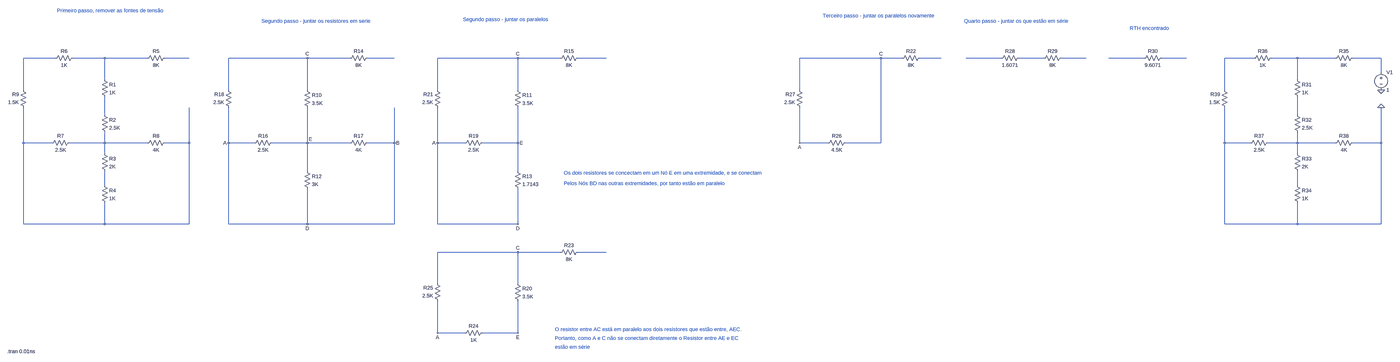
[diagram p0: schematic Mesh2.asc, whole sheet]
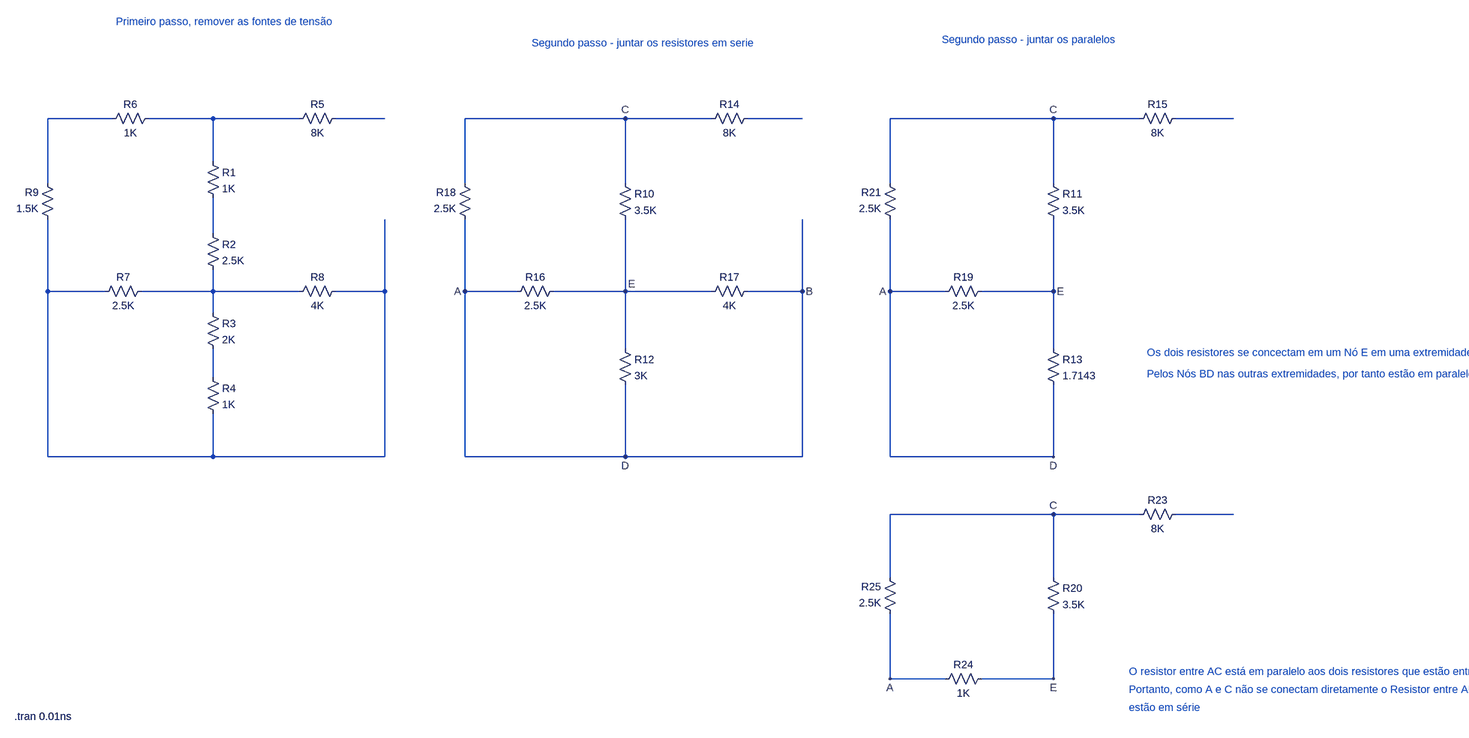
[diagram p1: schematic Mesh2.asc, part, row 1 of 1, column 1 of 2]
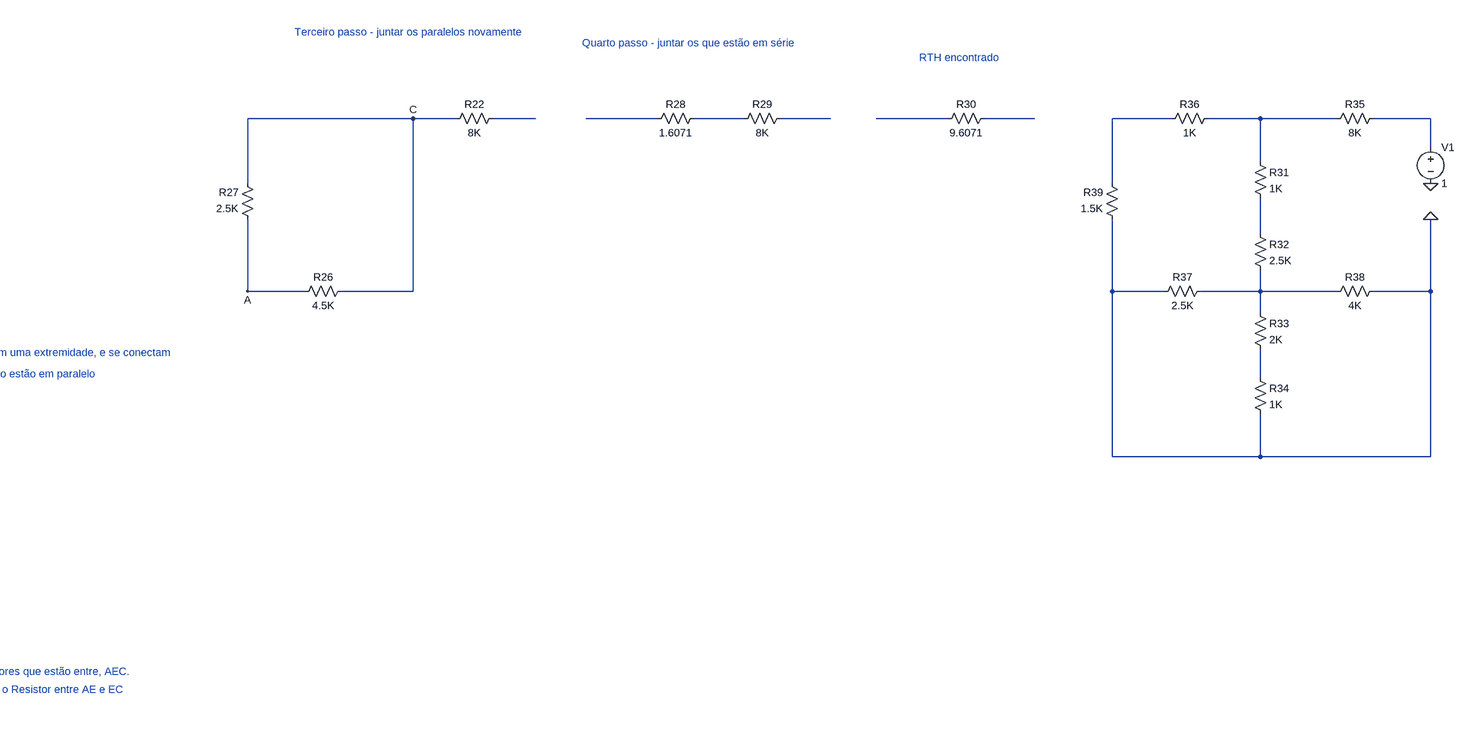
[diagram p2: schematic Mesh2.asc, part, row 1 of 1, column 2 of 2]
Mesh2.asc, the LTspice schematic file:
Version 4
SHEET 1 7416 1708
WIRE 96 16 -48 16
WIRE 320 16 176 16
WIRE 512 16 320 16
WIRE 720 16 592 16
WIRE 1456 16 1088 16
WIRE 1648 16 1456 16
WIRE 1856 16 1728 16
WIRE 2576 16 2208 16
WIRE 2768 16 2576 16
WIRE 2976 16 2848 16
WIRE 4560 16 4192 16
WIRE 4656 16 4560 16
WIRE 4832 16 4736 16
WIRE 5312 16 5152 16
WIRE 5504 16 5392 16
WIRE 5696 16 5584 16
WIRE 5984 16 5824 16
WIRE 6176 16 6064 16
WIRE 6736 16 6592 16
WIRE 6960 16 6816 16
WIRE 7152 16 6960 16
WIRE 7360 16 7232 16
WIRE 7360 80 7360 16
WIRE 320 112 320 16
WIRE 6960 112 6960 16
WIRE -48 160 -48 16
WIRE 1088 160 1088 16
WIRE 1456 160 1456 16
WIRE 2208 160 2208 16
WIRE 2576 160 2576 16
WIRE 4192 160 4192 16
WIRE 6592 160 6592 16
WIRE 320 272 320 192
WIRE 6960 272 6960 192
WIRE -48 400 -48 240
WIRE 80 400 -48 400
WIRE 320 400 320 352
WIRE 320 400 160 400
WIRE 512 400 320 400
WIRE 720 400 720 240
WIRE 720 400 592 400
WIRE 1088 400 1088 240
WIRE 1216 400 1088 400
WIRE 1456 400 1456 240
WIRE 1456 400 1296 400
WIRE 1648 400 1456 400
WIRE 1856 400 1856 240
WIRE 1856 400 1728 400
WIRE 2208 400 2208 240
WIRE 2336 400 2208 400
WIRE 2576 400 2576 240
WIRE 2576 400 2416 400
WIRE 4192 400 4192 240
WIRE 4320 400 4192 400
WIRE 4560 400 4560 16
WIRE 4560 400 4400 400
WIRE 6592 400 6592 240
WIRE 6720 400 6592 400
WIRE 6960 400 6960 352
WIRE 6960 400 6800 400
WIRE 7152 400 6960 400
WIRE 7360 400 7360 240
WIRE 7360 400 7232 400
WIRE 320 448 320 400
WIRE 6960 448 6960 400
WIRE 1456 528 1456 400
WIRE 2576 528 2576 400
WIRE 320 592 320 528
WIRE 6960 592 6960 528
WIRE -48 768 -48 400
WIRE 320 768 320 672
WIRE 320 768 -48 768
WIRE 720 768 720 400
WIRE 720 768 320 768
WIRE 1088 768 1088 400
WIRE 1456 768 1456 608
WIRE 1456 768 1088 768
WIRE 1856 768 1856 400
WIRE 1856 768 1456 768
WIRE 2208 768 2208 400
WIRE 2576 768 2576 608
WIRE 2576 768 2208 768
WIRE 6592 768 6592 400
WIRE 6960 768 6960 672
WIRE 6960 768 6592 768
WIRE 7360 768 7360 400
WIRE 7360 768 6960 768
WIRE 2576 896 2208 896
WIRE 2768 896 2576 896
WIRE 2976 896 2848 896
WIRE 2208 1040 2208 896
WIRE 2576 1040 2576 896
WIRE 2208 1280 2208 1120
WIRE 2336 1280 2208 1280
WIRE 2576 1280 2576 1120
WIRE 2576 1280 2416 1280
FLAG 1088 400 A
FLAG 1856 400 B
FLAG 1456 16 C
FLAG 1456 768 D
FLAG 1456 400 E
FLAG 2208 400 A
FLAG 2576 16 C
FLAG 2576 768 D
FLAG 2576 400 E
FLAG 2208 1280 A
FLAG 2576 896 C
FLAG 2576 1280 E
FLAG 4192 400 A
FLAG 4560 16 C
FLAG 7360 160 0
FLAG 7360 240 0
SYMBOL res 304 96 R0
SYMATTR InstName R1
SYMATTR Value 1K
SYMBOL res 304 256 R0
SYMATTR InstName R2
SYMATTR Value 2.5K
SYMBOL res 304 432 R0
SYMATTR InstName R3
SYMATTR Value 2K
SYMBOL res 304 576 R0
SYMATTR InstName R4
SYMATTR Value 1K
SYMBOL res 608 0 R90
WINDOW 0 0 56 VBottom 2
WINDOW 3 32 56 VTop 2
SYMATTR InstName R5
SYMATTR Value 8K
SYMBOL res 192 0 R90
WINDOW 0 0 56 VBottom 2
WINDOW 3 32 56 VTop 2
SYMATTR InstName R6
SYMATTR Value 1K
SYMBOL res 176 384 R90
WINDOW 0 0 56 VBottom 2
WINDOW 3 32 56 VTop 2
SYMATTR InstName R7
SYMATTR Value 2.5K
SYMBOL res 608 384 R90
WINDOW 0 0 56 VBottom 2
WINDOW 3 32 56 VTop 2
SYMATTR InstName R8
SYMATTR Value 4K
SYMBOL res -32 256 R180
WINDOW 0 36 76 Left 2
WINDOW 3 36 40 Left 2
SYMATTR InstName R9
SYMATTR Value 1.5K
SYMBOL res 1440 144 R0
SYMATTR InstName R10
SYMATTR Value 3.5K
SYMBOL res 1440 512 R0
SYMATTR InstName R12
SYMATTR Value 3K
SYMBOL res 1744 0 R90
WINDOW 0 0 56 VBottom 2
WINDOW 3 32 56 VTop 2
SYMATTR InstName R14
SYMATTR Value 8K
SYMBOL res 1312 384 R90
WINDOW 0 0 56 VBottom 2
WINDOW 3 32 56 VTop 2
SYMATTR InstName R16
SYMATTR Value 2.5K
SYMBOL res 1744 384 R90
WINDOW 0 0 56 VBottom 2
WINDOW 3 32 56 VTop 2
SYMATTR InstName R17
SYMATTR Value 4K
SYMBOL res 1104 256 R180
WINDOW 0 36 76 Left 2
WINDOW 3 36 40 Left 2
SYMATTR InstName R18
SYMATTR Value 2.5K
SYMBOL res 2560 144 R0
SYMATTR InstName R11
SYMATTR Value 3.5K
SYMBOL res 2560 512 R0
SYMATTR InstName R13
SYMATTR Value 1.7143
SYMBOL res 2864 0 R90
WINDOW 0 0 56 VBottom 2
WINDOW 3 32 56 VTop 2
SYMATTR InstName R15
SYMATTR Value 8K
SYMBOL res 2432 384 R90
WINDOW 0 0 56 VBottom 2
WINDOW 3 32 56 VTop 2
SYMATTR InstName R19
SYMATTR Value 2.5K
SYMBOL res 2224 256 R180
WINDOW 0 36 76 Left 2
WINDOW 3 36 40 Left 2
SYMATTR InstName R21
SYMATTR Value 2.5K
SYMBOL res 2560 1024 R0
SYMATTR InstName R20
SYMATTR Value 3.5K
SYMBOL res 2864 880 R90
WINDOW 0 0 56 VBottom 2
WINDOW 3 32 56 VTop 2
SYMATTR InstName R23
SYMATTR Value 8K
SYMBOL res 2432 1264 R90
WINDOW 0 0 56 VBottom 2
WINDOW 3 32 56 VTop 2
SYMATTR InstName R24
SYMATTR Value 1K
SYMBOL res 2224 1136 R180
WINDOW 0 36 76 Left 2
WINDOW 3 36 40 Left 2
SYMATTR InstName R25
SYMATTR Value 2.5K
SYMBOL res 4416 384 R90
WINDOW 0 0 56 VBottom 2
WINDOW 3 32 56 VTop 2
SYMATTR InstName R26
SYMATTR Value 4.5K
SYMBOL res 4208 256 R180
WINDOW 0 36 76 Left 2
WINDOW 3 36 40 Left 2
SYMATTR InstName R27
SYMATTR Value 2.5K
SYMBOL res 4752 0 R90
WINDOW 0 0 56 VBottom 2
WINDOW 3 32 56 VTop 2
SYMATTR InstName R22
SYMATTR Value 8K
SYMBOL res 5408 0 R90
WINDOW 0 0 56 VBottom 2
WINDOW 3 32 56 VTop 2
SYMATTR InstName R28
SYMATTR Value 1.6071
SYMBOL res 5600 0 R90
WINDOW 0 0 56 VBottom 2
WINDOW 3 32 56 VTop 2
SYMATTR InstName R29
SYMATTR Value 8K
SYMBOL res 6080 0 R90
WINDOW 0 0 56 VBottom 2
WINDOW 3 32 56 VTop 2
SYMATTR InstName R30
SYMATTR Value 9.6071
SYMBOL res 6944 96 R0
SYMATTR InstName R31
SYMATTR Value 1K
SYMBOL res 6944 256 R0
SYMATTR InstName R32
SYMATTR Value 2.5K
SYMBOL res 6944 432 R0
SYMATTR InstName R33
SYMATTR Value 2K
SYMBOL res 6944 576 R0
SYMATTR InstName R34
SYMATTR Value 1K
SYMBOL res 7248 0 R90
WINDOW 0 0 56 VBottom 2
WINDOW 3 32 56 VTop 2
SYMATTR InstName R35
SYMATTR Value 8K
SYMBOL res 6832 0 R90
WINDOW 0 0 56 VBottom 2
WINDOW 3 32 56 VTop 2
SYMATTR InstName R36
SYMATTR Value 1K
SYMBOL res 6816 384 R90
WINDOW 0 0 56 VBottom 2
WINDOW 3 32 56 VTop 2
SYMATTR InstName R37
SYMATTR Value 2.5K
SYMBOL res 7248 384 R90
WINDOW 0 0 56 VBottom 2
WINDOW 3 32 56 VTop 2
SYMATTR InstName R38
SYMATTR Value 4K
SYMBOL res 6608 256 R180
WINDOW 0 36 76 Left 2
WINDOW 3 36 40 Left 2
SYMATTR InstName R39
SYMATTR Value 1.5K
SYMBOL voltage 7360 64 R0
SYMATTR InstName V1
SYMATTR Value 1
TEXT 1248 -152 Left 2 ;Segundo passo - juntar os resistores em serie
TEXT 2328 -160 Left 2 ;Segundo passo - juntar os paralelos
TEXT 2784 536 Left 2 ;Os dois resistores se concectam em um Nó E em uma extremidade, e se conectam
TEXT 2784 584 Left 2 ;Pelos Nós BD nas outras extremidades, por tanto estão em paralelo
TEXT 2744 1264 Left 2 ;O resistor entre AC está em paralelo aos dois resistores que estão entre, AEC.
TEXT 2744 1304 Left 2 ;Portanto, como A e C não se conectam diretamente o Resistor entre AE e EC
TEXT 2744 1344 Left 2 ;estão em série
TEXT 4296 -176 Left 2 ;Terceiro passo - juntar os paralelos novamente
TEXT 5144 -152 Left 2 ;Quarto passo - juntar os que estão em série
TEXT 5920 -120 Left 2 ;RTH encontrado
TEXT 104 -200 Left 2 ;Primeiro passo, remover as fontes de tensão
TEXT -122 1364 Left 2 !.tran 0.01ns

The netlist it stands for:
* Mesh2.asc
R1 N002 N015 1K
R2 N015 N018 2.5K
R3 N018 N020 2K
R4 N020 N017 1K
R5 N003 N002 8K
R6 N002 N001 1K
R7 N018 N017 2.5K
R8 N017 N018 4K
R9 N017 N001 1.5K
R10 C E 3.5K
R12 E D 3K
R14 N004 C 8K
R16 E D 2.5K
R17 D E 4K
R18 D C 2.5K
R11 C E 3.5K
R13 E D 1.7143
R15 N005 C 8K
R19 E D 2.5K
R21 D C 2.5K
R20 C E 3.5K
R23 N022 C 8K
R24 E D 1K
R25 D C 2.5K
R26 C D 4.5K
R27 D C 2.5K
R22 N006 C 8K
R28 N008 N007 1.6071
R29 N009 N008 8K
R30 N011 N010 9.6071
R31 N013 N016 1K
R32 N016 N019 2.5K
R33 N019 N021 2K
R34 N021 0 1K
R35 N014 N013 8K
R36 N013 N012 1K
R37 N019 0 2.5K
R38 0 N019 4K
R39 0 N012 1.5K
V1 N014 0 1
* Segundo passo - juntar os resistores em serie
* Segundo passo - juntar os paralelos
* Os dois resistores se concectam em um Nó E em uma extremidade, e se conectam
* Pelos Nós BD nas outras extremidades, por tanto estão em paralelo
* O resistor entre AC está em paralelo aos dois resistores que estão entre, AEC.
* Portanto, como A e C não se conectam diretamente o Resistor entre AE e EC
* estão em série
* Terceiro passo - juntar os paralelos novamente
* Quarto passo - juntar os que estão em série
* RTH encontrado
* Primeiro passo, remover as fontes de tensão
.tran 0.01ns
.backanno
.end